# EAGLE design Power (EAGLE 6.5.0)
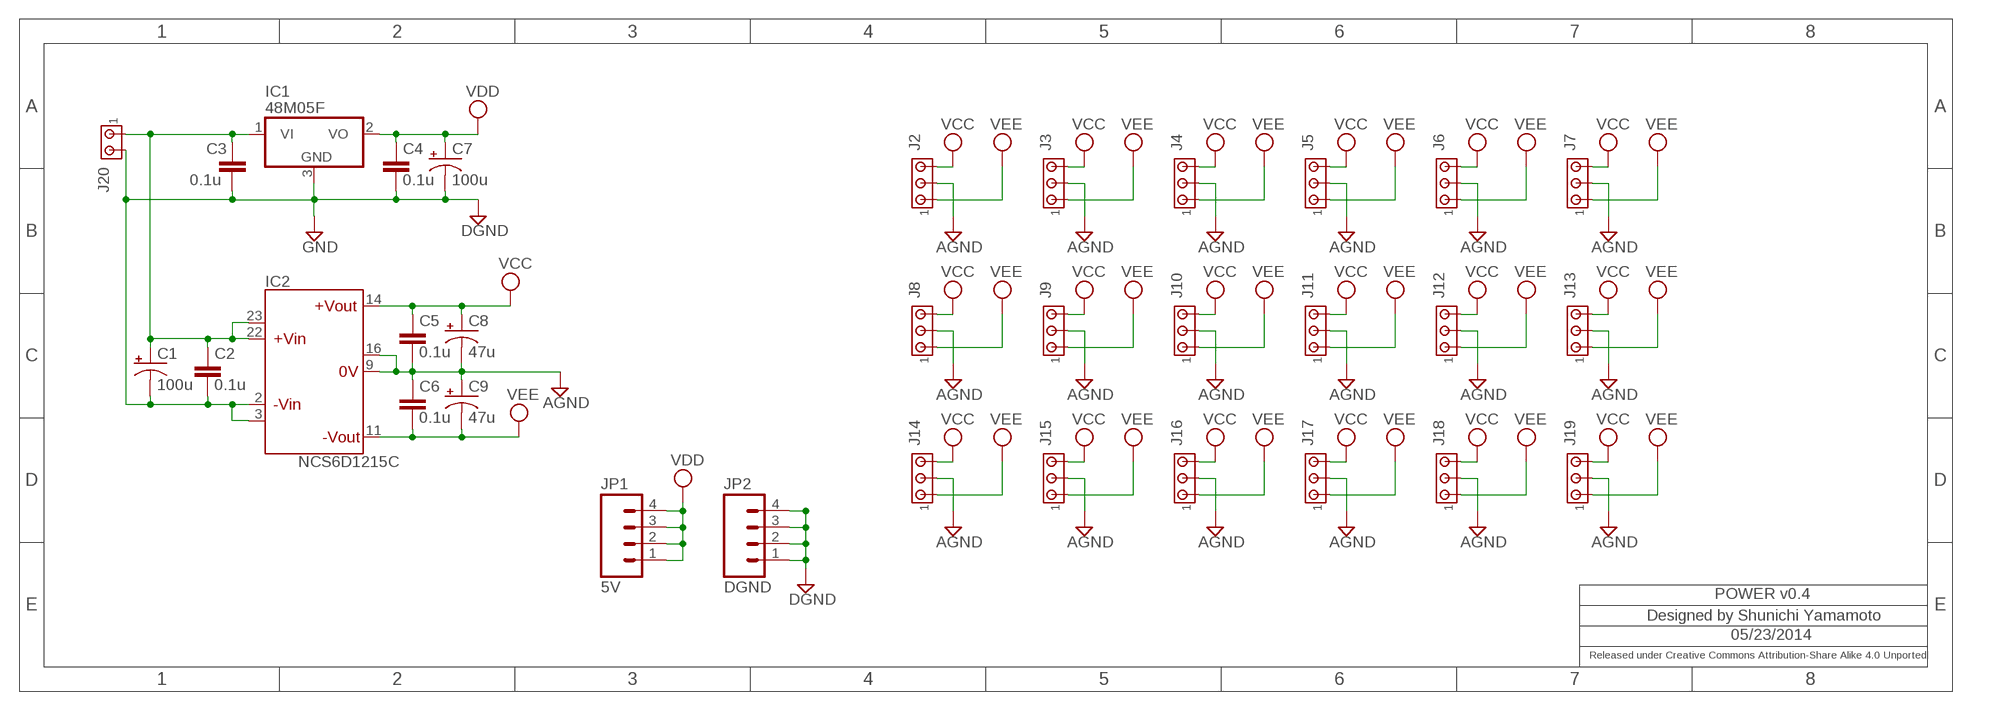
[diagram p0: schematic, sheet 1]

## Parts
C1  100u  CPOL-USUD-6,3X7,7  [UD-6,3X7,7_NICHICON]
C2  0.1u  C-EUC2012  [C2012]
C3  0.1u  C-EUC2012  [C2012]
C4  0.1u  C-EUC2012  [C2012]
C5  0.1u  C-EUC2012  [C2012]
C6  0.1u  C-EUC2012  [C2012]
C7  100u  CPOL-USUD-6,3X7,7  [UD-6,3X7,7_NICHICON]
C8  47u  CPOL-USUD-5X5,8  [UD-5X5,8_NICHICON]
C9  47u  CPOL-USUD-5X5,8  [UD-5X5,8_NICHICON]
IC1  48M05F  7805DT  [TO252]
IC2  NCS6D1215C  [NCS6D1215C]
J2  MTA03-156  [1X3MTA]
J3  MTA03-156  [1X3MTA]
J4  MTA03-156  [1X3MTA]
J5  MTA03-156  [1X3MTA]
J6  MTA03-156  [1X3MTA]
J7  MTA03-156  [1X3MTA]
J8  MTA03-156  [1X3MTA]
J9  MTA03-156  [1X3MTA]
J10  MTA03-156  [1X3MTA]
J11  MTA03-156  [1X3MTA]
J12  MTA03-156  [1X3MTA]
J13  MTA03-156  [1X3MTA]
J14  MTA03-156  [1X3MTA]
J15  MTA03-156  [1X3MTA]
J16  MTA03-156  [1X3MTA]
J17  MTA03-156  [1X3MTA]
J18  MTA03-156  [1X3MTA]
J19  MTA03-156  [1X3MTA]
J20  MTA02-156  [1X2MTA]
JP1  5V  M04PTH  [1X04]
JP2  DGND  M04PTH  [1X04]

## Nets
AGND: C5.2 C6.1 C8.- C9.+ IC2.9(0V) IC2.16(0V2) J2.2 J3.2 J4.2 J5.2 J6.2 J7.2 J8.2 J9.2 J10.2 J11.2 J12.2 J13.2 J14.2 J15.2 J16.2 J17.2 J18.2 J19.2
GND: C1.- C2.2 C3.2 C4.2 C7.- IC1.3(GND) IC2.2(-VIN) IC2.3(-VIN2) J20.2 JP2.1 JP2.2 JP2.3 JP2.4 ; supply symbol labelled DGND
N$2: C1.+ C2.1 C3.1 IC1.1(VI) IC2.22(+VIN) IC2.23(+VIN2) J20.1
VCC: C5.1 C8.+ IC2.14(+VOUT) J2.3 J3.3 J4.3 J5.3 J6.3 J7.3 J8.3 J9.3 J10.3 J11.3 J12.3 J13.3 J14.3 J15.3 J16.3 J17.3 J18.3 J19.3
VDD: C4.1 C7.+ IC1.2(VO) JP1.1 JP1.2 JP1.3 JP1.4
VEE: C6.2 C9.- IC2.11(-VOUT) J2.1 J3.1 J4.1 J5.1 J6.1 J7.1 J8.1 J9.1 J10.1 J11.1 J12.1 J13.1 J14.1 J15.1 J16.1 J17.1 J18.1 J19.1

## Notes on the sheet
- POWER v0.4
- Designed by Shunichi Yamamoto
- 05/23/2014
- Released under Creative Commons Attribution-Share Alike 4.0 Unported

## Library data of the parts
C1 C7-C9 = rcl:CPOL-US: POLARIZED CAPACITOR, American symbol
C2-C6 = rcl:C-EU: CAPACITOR, European symbol
IC1 = linear:78*: Positive VOLTAGE REGULATOR Source: http://cache.national.com/ds/LM/LM78L05.pdf http://www.fairchildsemi.com/ds/LM/LM7805.pdf
IC2 = tkrworks:NCS6D1215C
J2-J19 = con-amp:MTA03-156: AMP connector
J20 = con-amp:MTA02-156: AMP connector
JP1 JP2 = SparkFun:M04: Header 4 Standard 4-pin 0.1" header. Use with straight break away headers (SKU : PRT-00116), right angle break away headers (PRT-00553), swiss pins (PRT-00743), machine pins (PRT-00117), and female headers (PRT-00115). Molex polarized connector foot print use with SKU : PRT-08231 with associated crimp pins and housings. 1MM SMD Version SKU: PRT-10208

## Board
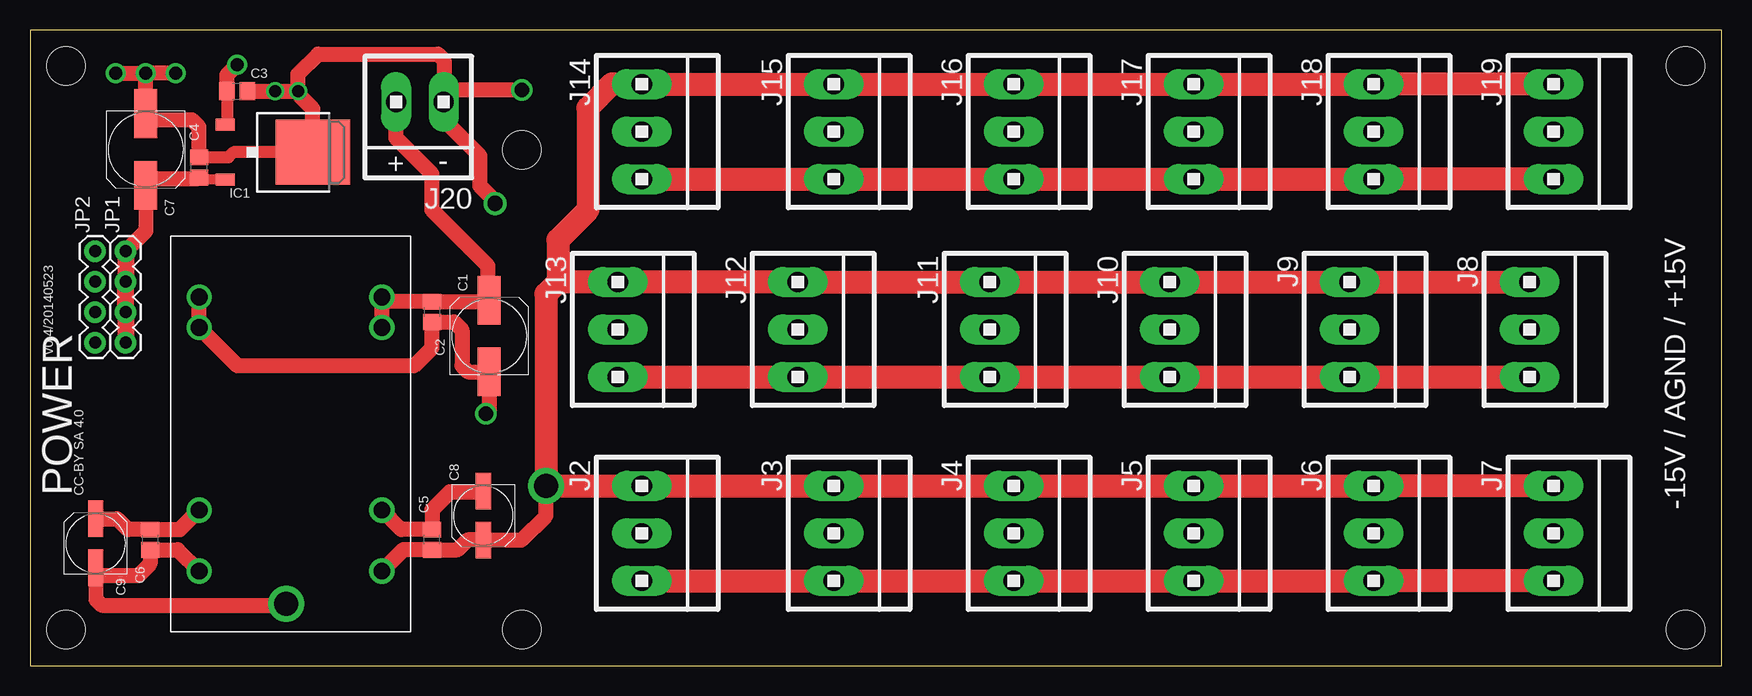
[diagram p1: board, top side]
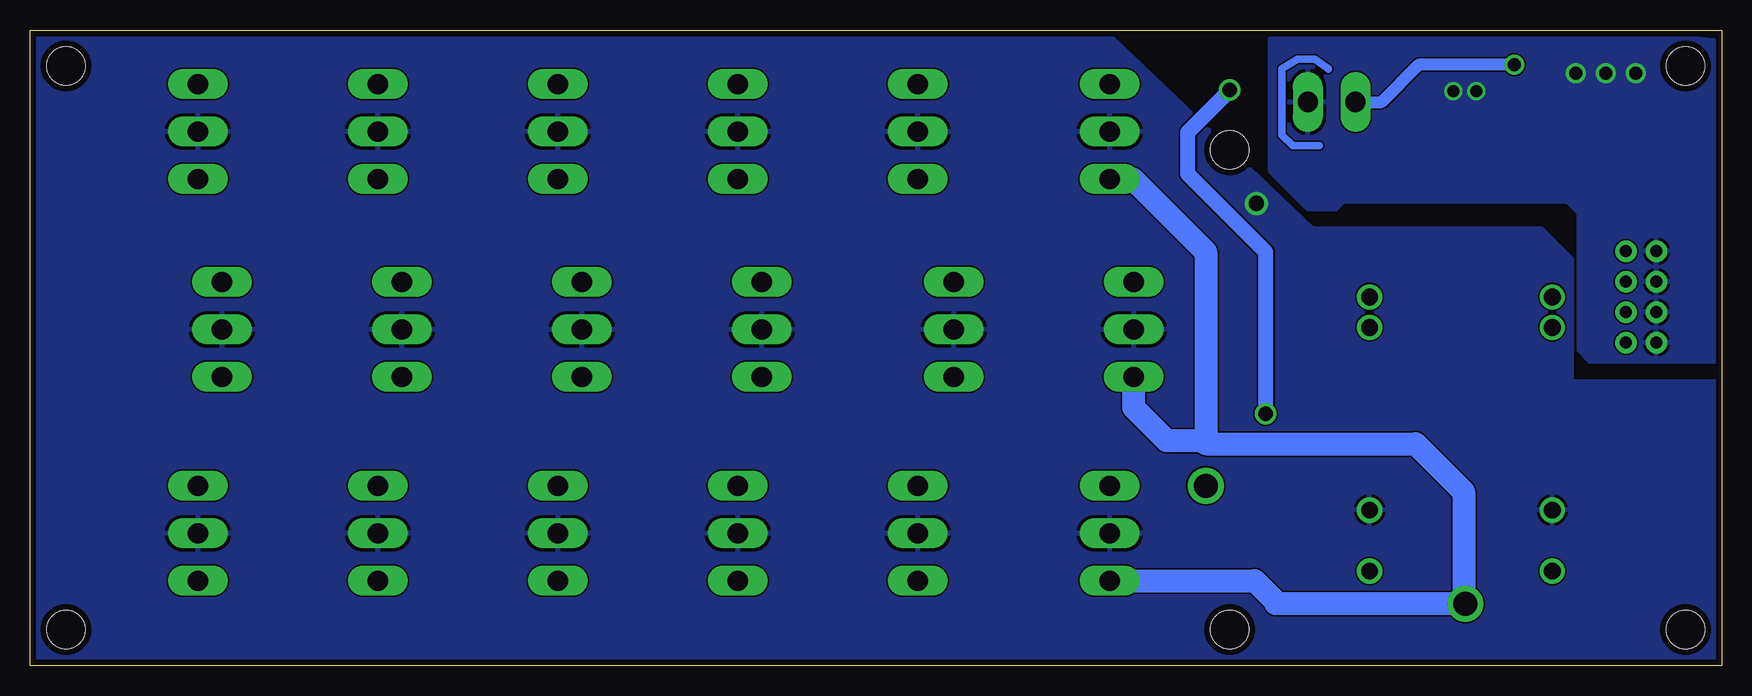
[diagram p2: board, bottom side, seen from below]

Size 141 x 53 mm. Coordinates in mm from the lower left corner, seen from the top.
Outline: 141,53 0,53 0,0 141,0 141,53
Copper layers (1*16): Top 0.035mm / dielectric 1.53mm / Bottom 0.035mm
Design rules "pban_5mil-l2": minimum track width 5mil, minimum drill 0.3mm, track to track 5mil, track to pad 0.229mm, pad to pad 5mil, via to via 5mil, smd to smd 5mil, copper to edge 0.5mm, drill to drill 0.5mm, minimum pad ring 0.15mm, minimum via ring 0.15mm, stop-mask expansion 4mil, vias tented up to drill 0.35mm, thermal gap 10mil
Holes 3.2 mm at 41,43 41,3 3,3 3,50 138,50 138,3

### Footprints (pad centres in the part's own frame; a part is rotated, then mirrored left to right if it is on the bottom)
UD-6,3X7,7_NICHICON = smd 4.064 x 1.93: + 2.985,0; - -2.985,0
C2012 = smd 1.3 x 1.5: 1 -0.85,0; 2 0.85,0
UD-5X5,8_NICHICON = smd 3.048 x 1.27: + 2.042,0; - -2.018,0
TO252 = smd 1 x 1.6: 1 -2.28,-4.8; 2 2.28,-4.8 | smd 5.4 x 6.2: 3 0,2.5
NCS6D1215C = drill 1.4: 2 -7.62,11.43; 3 -7.62,8.89; 9 -7.62,-6.35; 11 -7.62,-11.43; 14 7.62,-11.43; 16 7.62,-6.35; 22 7.62,8.89; 23 7.62,11.43
1X3MTA = drill 1.676 long: 1 3.937,0; 2 -0.025,0; 3 -3.988,0
1X2MTA = drill 1.676 long: 1 1.981,0; 2 -1.981,0
1X04 = drill 1.016 pad 1.778: 1 0,0; 2 2.54,0; 3 5.08,0; 4 7.62,0

### Placement (x,y rotation side)
C1  38.28,27.48 90 top
C2  33.5,29.5 270 top
C3  17.27,47.88 0 top
C4  14.1,41.53 90 top
C5  33.5,10.5 90 top
C6  10,10.5 270 top
C7  9.65,43.03 270 top
C8  37.78,12.51 270 top
C9  5.47,10.19 90 top
IC1  21.08,42.8 270 top
IC2  21.72,19.31 0 top
J2  51,11 270 top
J3  67,11 270 top
J4  82,11 270 top
J5  97,11 270 top
J6  112,11 270 top
J7  127,11 270 top
J8  125,28 270 top
J9  110,28 270 top
J10  95,28 270 top
J11  80,28 270 top
J12  64,28 270 top
J13  49,28 270 top
J14  51,44.5 270 top
J15  67,44.5 270 top
J16  82,44.5 270 top
J17  97,44.5 270 top
J18  112,44.5 270 top
J19  127,44.5 270 top
J20  32.5,47 180 top
JP1  7.97,34.55 270 top
JP2  5.43,34.55 270 top

### Tracks (layer width: path | path; a pad name or v marks a point on that pad's centre or on a via)
AGND  (via drill 1.27)
  Top 1.27: IC2.16 30.95,11.35 C5.2 33.5,13 35,14.5 37.76,14.5 C8.- | IC2.9 12.49,11.35 C6.1 8.15,11.35 7.27,12.23 C9.+ | v38.77,38.53 38.77,38.73 37.5,40 37.5,42.5 34.5,45.5 34.5,47
  pour Bottom: 141.66,52.49 50.95,52.49 34.1,36.45 15.05,36.45 12.51,33.91 12.51,23.68 -0.65,23.68 -0.65,-0.52 141.66,-0.52
GND  (via drill 1, 1.1, 1.2)
  Top 0.813: 10.16,45.34 C7.-
  Top 1.016: IC1.3 16.95,42.8 16.54,42.38 C4.2
  Top 1.27: C3.2 v20.45,47.88 v22.35,47.88 22.35,49.35 24,51 34,51 34.5,50.5 34.5,47.02 J20.2 35.48,48 v41,48 | IC2.2 IC2.3 17.3,25 32,25 33.5,26.5 C2.2 35.35,28.65 36,28 36,25 36.5,24.5 C1.- | C7.- v9.65,49.38 | v7.15,49.38 v9.65,49.38 | v12.15,49.38 v9.65,49.38 | C4.2 14.1,44.9 13.5,45.5 10.31,45.5 10.16,45.34 | C1.- 38.27,21.27 v38,21 | C1.- | IC1.3 23.58,46.42 22.5,47.5
  Bottom 1.27: v38,21 38,34.5 44.5,41 44.5,44.5 v41,48
  pour Bottom: -0.5,52.01 -0.5,25.34 10.92,25.34 11.88,26.3 11.88,37.73 12.83,38.68 31.56,38.68 32.2,38.04 34.42,38.04 37.59,41.22 37.59,52.33 2.35,52.33
N$1
  Bottom 0.61: 33.51,43.34 35.73,43.34 36.64,44.25 36.64,49.79 35.37,50.56 33.88,50.56 32.79,49.79 32.79,49.75
N$2  (via drill 1.1)
  Top 1.016: C3.1 16.42,45.23 IC1.1
  Top 1.27: C3.1 16.42,49.26 v17.27,50.11 | IC2.22 IC2.23 29.73,30.35 C2.1 38.17,30.35 | 38.17,30.35 38.17,33.33 33.5,38 33.5,41 30.5,44 30.5,46.98 J20.1 | 38.17,30.35 C1.+
  Bottom 1.016: v17.27,50.11 25.21,50.11 28.32,47 J20.1
VCC  (via drill 2)
  Top 1.27: IC2.14 31.11,9.65 C5.1 35.65,9.65 36.47,10.46 C8.+ 40.97,10.46 43,12.5 v43,15
  Top 1.676: 44.01,31.99 44,32
  Top 1.93: 111.5,48.49 J17.3 J16.3 J15.3 J14.3 48.49,48.49 46.5,46.5 46.5,38 44,35.5 44,32 43,31 v43,15 51.99,15 J2.3 J3.3 J4.3 J5.3 111.5,14.99 | 111.5,48.49 J18.3 | J8.3 J9.3 J10.3 J11.3 J12.3 J13.3 44.01,31.99 | 111.5,14.99 J6.3 | J19.3 111.5,48.49 | J7.3 111.5,14.99
VDD
  Top 0.813: IC1.2 14.26,40.52 C4.1 13.87,40.45 13.87,40.58
  Top 1.27: 13.87,40.58 10.19,40.58 C7.+ 9.65,36.23 JP1.1
  Top 1.422: JP1.1 JP1.2 JP1.3 JP1.4
VEE  (via drill 2)
  Top 0.406: C9.- 5.47,7.53 5.5,7.5
  Top 1.27: IC2.11 12.33,9.65 C6.2 10,8.5 9,7.5 5.5,7.5 5.5,5.5 5.98,5.02 21.23,5.02 v21.36,5.16
  Top 1.93: J2.1 J3.1 J4.1 J5.1 J6.1 J7.1 | J8.1 J9.1 J10.1 J11.1 J12.1 J13.1 | J14.1 J15.1 J16.1 J17.1 J18.1 J19.1
  Bottom 1.93: 37,5.16 v21.36,5.16 21.5,5.29 21.5,14.5 25.5,18.5 43,18.5 43.25,18.75 | 37,5.16 37.16,5.16 | J2.1 38.91,7.06 37,5.16 | J12.1 63.56,24.06 | J14.1 49.06,40.56 43,34.5 43,19 43.25,18.75 | 43.25,18.75 46.25,18.75 49,21.5 J13.1

### Text on the board
tNames: + | - | v0.4/20140523 | POWER | CC-BY SA 4.0 | -15V / AGND / +15V